# Altium schematic sheet top_level.SchDoc: Top Level Block Diagram
size A4; DrawnBy: Juan I Carrano; DocumentNumber: 1; SheetNumber: 1; SheetTotal: 6
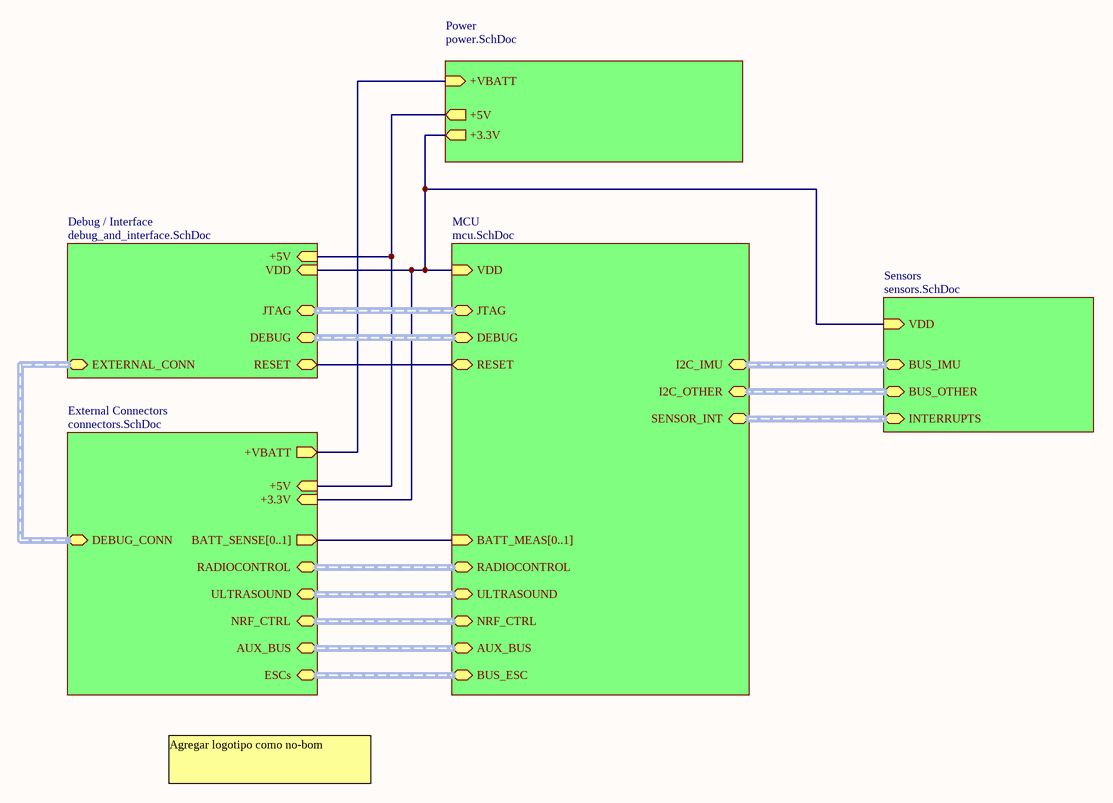
[diagram p0: top_level.SchDoc]

## Sub-sheets
Debug / Interface = debug_and_interface.SchDoc: VDD (in), JTAG (harness JTAG/SWD), DEBUG (harness Debug), RESET, EXTERNAL_CONN (harness ext_debug), +5V (in)
External Connectors = connectors.SchDoc: ESCs (harness SPI_BUS8), NRF_CTRL (harness nrf_ctrl), RADIOCONTROL (harness RC), BATT_SENSE[0..1] (out), +VBATT (out), AUX_BUS (harness SPI), +5V (in), +3.3V (in), ULTRASOUND (harness ultrasound), DEBUG_CONN (harness ext_debug)
MCU = mcu.SchDoc: JTAG (harness JTAG/SWD), VDD (in), DEBUG (harness Debug), BATT_MEAS[0..1] (in), I2C_IMU (harness i2c), I2C_OTHER (harness i2c), BUS_ESC (harness SPI_BUS8), RESET, RADIOCONTROL (harness RC), SENSOR_INT (harness sensor_interrupts), NRF_CTRL (harness nrf_ctrl), ULTRASOUND (harness ultrasound), AUX_BUS (harness SPI)
Power = power.SchDoc: +VBATT (in), +3.3V (out), +5V (out)
Sensors = sensors.SchDoc: VDD (in), BUS_IMU (harness i2c), INTERRUPTS (harness sensor_interrupts), BUS_OTHER (harness i2c)

## Nets
(unnamed): sheet MCU/VDD, sheet Sensors/VDD, sheet Debug / Interface/VDD, sheet Power/+3.3V, sheet External Connectors/+3.3V
(unnamed): sheet MCU/RESET, sheet Debug / Interface/RESET
(unnamed): sheet Debug / Interface/+5V, sheet Power/+5V, sheet External Connectors/+5V
(unnamed): sheet Power/+VBATT, sheet External Connectors/+VBATT

## Buses and harness runs
bus sheet External Connectors/BATT_SENSE[0..1] = sheet MCU/BATT_MEAS[0..1]
harness sheet Debug / Interface/DEBUG = sheet MCU/DEBUG
harness sheet Debug / Interface/EXTERNAL_CONN = sheet External Connectors/DEBUG_CONN
harness sheet Debug / Interface/JTAG = sheet MCU/JTAG
harness sheet External Connectors/AUX_BUS = sheet MCU/AUX_BUS
harness sheet External Connectors/ESCs = sheet MCU/BUS_ESC
harness sheet External Connectors/NRF_CTRL = sheet MCU/NRF_CTRL
harness sheet External Connectors/RADIOCONTROL = sheet MCU/RADIOCONTROL
harness sheet External Connectors/ULTRASOUND = sheet MCU/ULTRASOUND
harness sheet MCU/I2C_IMU = sheet Sensors/BUS_IMU
harness sheet MCU/I2C_OTHER = sheet Sensors/BUS_OTHER
harness sheet MCU/SENSOR_INT = sheet Sensors/INTERRUPTS

## Notes on the sheet
- Agregar logotipo como no-bom
- Title
- Size:
- Date:
- A4
- Number:
- Time:
- Revision:
- Sheet
- of
- File:
- Drawn by: